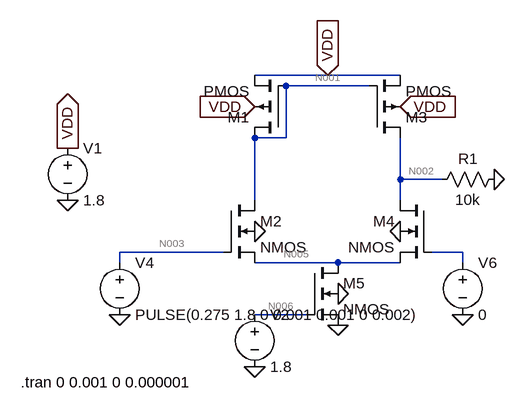
[diagram p0: schematic 5t_ota.asc]
5t_ota.asc, the LTspice schematic file:
Version 4
SHEET 1 880 680
WIRE 176 32 64 32
WIRE 288 32 176 32
WIRE 240 48 112 48
WIRE 112 128 112 48
WIRE 112 128 64 128
WIRE 288 192 288 128
WIRE 352 192 288 192
WIRE 64 224 64 128
WIRE 288 224 288 192
WIRE 16 304 -144 304
WIRE 384 304 336 304
WIRE -144 320 -144 304
WIRE 192 320 64 320
WIRE 288 320 192 320
WIRE 384 320 384 304
WIRE 144 400 64 400
FLAG -224 224 0
FLAG 64 480 0
FLAG 192 416 0
FLAG 192 368 0
FLAG 288 272 0
FLAG 64 272 0
FLAG 176 32 VDD
IOPIN 176 32 In
FLAG 64 80 VDD
IOPIN 64 80 In
FLAG 288 80 VDD
IOPIN 288 80 In
FLAG -224 144 VDD
IOPIN -224 144 Out
FLAG -144 400 0
FLAG 384 400 0
FLAG 432 192 0
SYMBOL pmos4 112 128 R180
SYMATTR InstName M1
SYMATTR Value2 l=1um w=180nm
SYMBOL nmos4 16 224 R0
SYMATTR InstName M2
SYMATTR Value2 l=100nm w=120nm
SYMBOL pmos4 240 128 M180
SYMATTR InstName M3
SYMATTR Value2 l=1um w=180nm
SYMBOL nmos4 336 224 M0
SYMATTR InstName M4
SYMATTR Value2 l=100nm w=120nm
SYMBOL voltage -224 128 R0
WINDOW 123 0 0 Left 0
WINDOW 39 0 0 Left 0
SYMATTR InstName V1
SYMATTR Value 1.8
SYMBOL voltage 64 384 R0
WINDOW 123 0 0 Left 0
WINDOW 39 0 0 Left 0
SYMATTR InstName V2
SYMATTR Value 1.8
SYMBOL nmos4 144 320 R0
SYMATTR InstName M5
SYMATTR Value2 l=100nm w=120nm
SYMBOL voltage -144 304 R0
WINDOW 123 0 0 Left 0
WINDOW 39 0 0 Left 0
SYMATTR InstName V4
SYMATTR Value PULSE(0.275 1.8 0 0.001 0.001 0 0.002)
SYMBOL voltage 384 304 R0
WINDOW 123 0 0 Left 0
WINDOW 39 0 0 Left 0
SYMATTR InstName V6
SYMATTR Value 0
SYMBOL res 336 208 R270
WINDOW 0 32 56 VTop 2
WINDOW 3 0 56 VBottom 2
SYMATTR InstName R1
SYMATTR Value 10k
TEXT -296 504 Left 2 !.tran 0 0.001 0 0.000001

The netlist it stands for:
* 5t_ota.asc
M1 N001 N001 VDD VDD PMOS l=1um w=180nm
M2 N001 N003 N005 0 NMOS l=100nm w=120nm
M3 N002 N001 VDD VDD PMOS l=1um w=180nm
M4 N002 N004 N005 0 NMOS l=100nm w=120nm
V1 VDD 0 1.8
V2 N006 0 1.8
M5 N005 N006 0 0 NMOS l=100nm w=120nm
V4 N003 0 PULSE(0.275 1.8 0 0.001 0.001 0 0.002)
V6 N004 0 0
R1 N002 0 10k
.model NMOS NMOS
.model PMOS PMOS
.lib standard.mos
.tran 0 0.001 0 0.000001
.backanno
.end

* Results of the author's LTspice run, read from the files saved beside the schematic
* Operating Point, zero values left out:
*   V(n001) = 1.137 V
*   V(vdd) = 1.8 V
*   V(n003) = 275 mV
*   V(n005) = 18.39 mV
*   V(n002) = 7.902 mV
*   V(n006) = 1.8 V
*   Id(M5) = 790.2 nA
*   Is(M5) = -790.2 nA
*   Id(M2) = 790.2 nA
*   Ib(M2) = -1.171 pA
*   Is(M2) = -790.2 nA
*   Id(M3) = -790.2 nA
*   Ib(M3) = 1.802 pA
*   Is(M3) = 790.2 nA
*   Id(M1) = -790.2 nA
*   Is(M1) = 790.2 nA
*   I(R1) = 790.2 nA
*   I(V1) = -1.58 µA
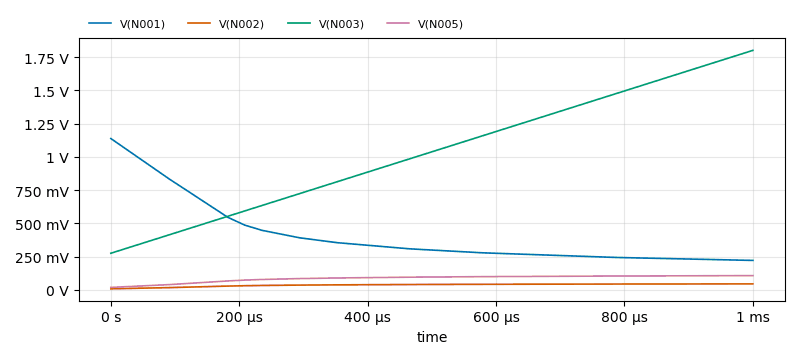
[diagram p1: Transient Analysis of 5t_ota.asc, plotted from the saved traces]
* Transient Analysis, 1 run:
*   V(N001): min 221.3 mV, max 1.137 V, average 399.6 mV, rms 463.8 mV, last 221.3 mV
*   V(N002): min 7.902 mV, max 44.86 mV, average 36.3 mV, rms 37.67 mV, last 44.86 mV
*   V(N003): min 275 mV, max 1.8 V, average 1.037 V, rms 1.131 V, last 1.8 V
*   V(N005): min 18.39 mV, max 107 mV, average 86.26 mV, rms 89.6 mV, last 107 mV